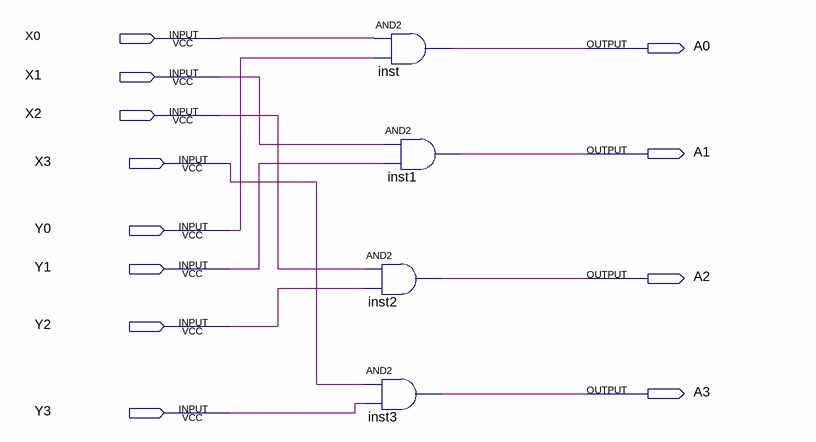
[diagram p0: schematic sheet]
// Quartus schematic And_four_bit.bdf as structural Verilog: 4 symbols, 12 pins
module And_four_bit (
  input  X0,
  input  X1,
  input  X2,
  input  X3,
  input  Y0,
  input  Y1,
  input  Y2,
  input  Y3,
  output A0,
  output A1,
  output A2,
  output A3
);

  and inst (A0, X0, Y0);
  and inst2 (A2, X2, Y2);
  and inst3 (A3, X3, Y3);
  and inst1 (A1, X1, Y1);
endmodule
